# Altium schematic sheet MP9928_converter.SchDoc
size A; SheetNumber: 4; SheetTotal: 8
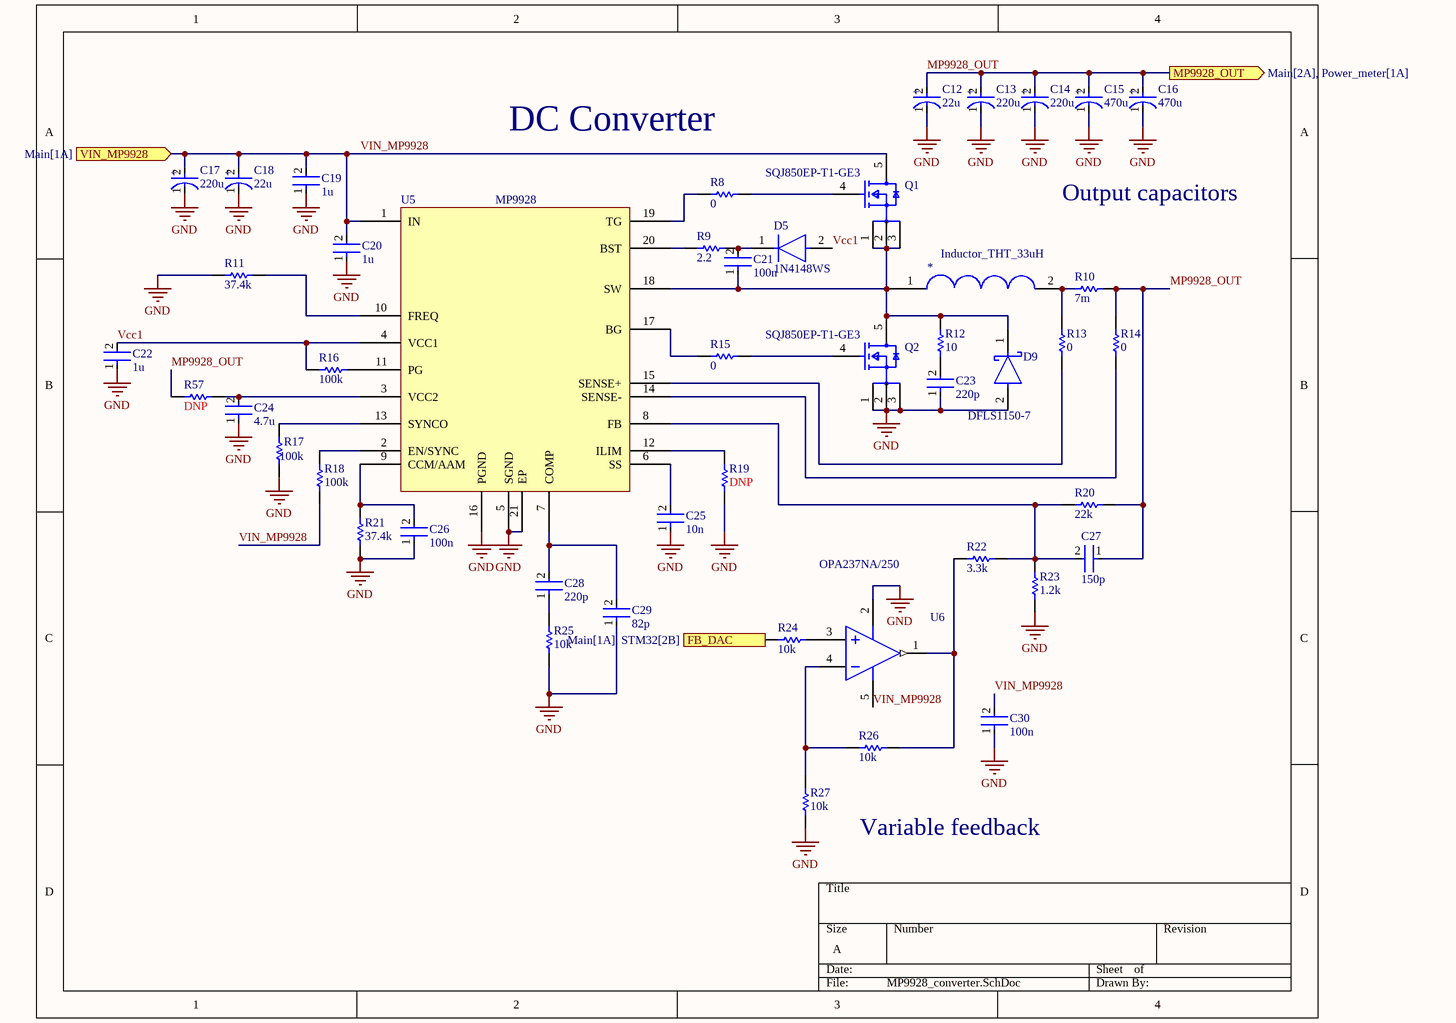
[diagram p0: MP9928_converter.SchDoc]

## Parts
*  Inductor_THT_33uH  [Inductor_THT]
C12  22u  [FP-FKG-MFG]
C13  220u  [FP-FKG-MFG]
C14  220u  [FP-FKG-MFG]
C15  470u  [FP-FKJ16-MFG]
C16  470u  [FP-FKJ16-MFG]
C17  220u  [FP-FKG-MFG]
C18  22u  [FP-FKG-MFG]
C19  1u  [FP-0805-L_2_01_0_2-W_1_25-IPC_B]
C20  1u  [FP-0805-L_2_01_0_2-W_1_25-IPC_B]
C21  100n  [FP-0805-L_2_01_0_2-W_1_25-IPC_B]
C22  1u  [FP-0805-L_2_01_0_2-W_1_25-IPC_B]
C23  220p  [FP-0805-L_2_01_0_2-W_1_25-IPC_B]
C24  4.7u  [FP-0805-L_2_01_0_2-W_1_25-IPC_B]
C25  10n  [FP-0805-L_2_01_0_2-W_1_25-IPC_B]
C26  100n  [FP-0805-L_2_01_0_2-W_1_25-IPC_B]
C27  150p  [FP-0805-L_2_01_0_2-W_1_25-IPC_B]
C28  220p  [FP-0805-L_2_01_0_2-W_1_25-IPC_B]
C29  82p  [FP-0805-L_2_01_0_2-W_1_25-IPC_B]
C30  100n  [FP-0805-L_2_01_0_2-W_1_25-IPC_B]
D5  1N4148WS  [FP-477AB-IPC_C]
D9  DFLS1150-7  [FP-PowerDI123-MFG]
Q1  SQJ850EP-T1-GE3  [FP-T16-0221-SINGLE-MFG]
Q2  SQJ850EP-T1-GE3  [FP-T16-0221-SINGLE-MFG]
R8  0  [RESC2013X50X30LL20T20]
R9  2.2  [RESC2013X50X30LL20T20]
R10  7m  [RESC3216X70X50NL05T20]
R11  37.4k  [RESC2013X50X30LL20T20]
R12  10  [RESC2013X50X30LL20T20]
R13  0  [RESC2013X50X30LL20T20]
R14  0  [RESC2013X50X30LL20T20]
R15  0  [RESC2013X50X30LL20T20]
R16  100k  [RESC2013X50X30LL20T20]
R17  100k  [RESC2013X50X30LL20T20]
R18  100k  [RESC2013X50X30LL20T20]
R19  DNP  [RESC2013X50X30LL20T20]
R20  22k  [RESC2013X50X30LL20T20]
R21  37.4k  [RESC2013X50X30LL20T20]
R22  3.3k  [RESC2013X50X30LL20T20]
R23  1.2k  [RESC2013X50X30LL20T20]
R24  10k  [RESC2013X50X30LL20T20]
R25  10k  [RESC2013X50X30LL20T20]
R26  10k  [RESC2013X50X30LL20T20]
R27  10k  [RESC2013X50X30LL20T20]
R57  DNP  [RESC2013X50X30LL20T20]
U5  MP9928  [SOP65P640X110-21N]
U6  OPA237NA/250  [DBV0005A_N]

## Ports
FB_DAC (in, see Main[1A], STM32[2B]), MP9928_OUT (out, see Main[2A], Power_meter[1A]), VIN_MP9928 (in, see Main[1A])

## Nets
GND: C12.1(C) C13.1(C) C14.1(C) C15.1(C) C16.1(C) C17.1(C) C18.1(C) C19.1 C20.1 C22.1 C23.1 C24.1 C25.1 C26.1 C29.1 C30.1 D9.2(A) Q2.1(S) Q2.2(S) Q2.3(S) R11.1 R17.2 R19.2 R21.2 R23.2 R25.2 R27.2 U5.5(SGND) U5.16(PGND) U5.21(EP) U6.2(V-)
FB_DAC: R24.1 ; port FB_DAC
MP9928_OUT: C12.2(A) C13.2(A) C14.2(A) C15.2(A) C16.2(A) C27.1 R10.2 R14.1 R20.2 R57.1 ; port MP9928_OUT
Vcc1: C22.2 D5.2(A) R16.2 U5.4(VCC1)
VIN_MP9928: C17.2(A) C18.2(A) C19.2 C20.2 C30.2 Q1.5(D) R18.2 U5.1(IN) U6.5(V+) ; port VIN_MP9928
Net*_1: *.1 C21.1 D9.1(C) Q1.1(S) Q1.2(S) Q1.3(S) Q2.5(D) R12.1 U5.18(SW)
Net*_2: *.2 R10.1 R13.1
NetC21_2: C21.2 D5.1(C) R9.1
NetC23_2: C23.2 R12.2
NetC24_2: C24.2 R57.2 U5.3(VCC2)
NetC25_2: C25.2 U5.6(SS)
NetC26_2: C26.2 R21.1 U5.9(CCM/AAM)
NetC27_2: C27.2 R20.1 R22.1 R23.1 U5.8(FB)
NetC28_1: C28.1 R25.1
NetC28_2: C28.2 C29.2 U5.7(COMP)
NetQ1_4: Q1.4(G) R8.1
NetQ2_4: Q2.4(G) R15.1
NetR8_2: R8.2 U5.19(TG)
NetR9_2: R9.2 U5.20(BST)
NetR11_2: R11.2 U5.10(FREQ)
NetR13_2: R13.2 U5.15(SENSE+)
NetR14_2: R14.2 U5.14(SENSE-)
NetR15_2: R15.2 U5.17(BG)
NetR16_1: R16.1 U5.11(PG)
NetR17_1: R17.1 U5.13(SYNCO)
NetR18_1: R18.1 U5.2(EN/SYNC)
NetR19_1: R19.1 U5.12(ILIM)
NetR22_2: R22.2 R26.2 U6.1(OUT)
NetR24_2: R24.2 U6.3(IN+)
NetR26_1: R26.1 R27.1 U6.4(IN-)

## Notes on the sheet
- DC Converter
- Output capacitors
- Variable feedback
- (in symbol CMP-05427-000014-1) +
- (in symbol CMP-05427-002167-1) +

## Library data of the parts
C12-C14 C17 C18 = CMP-05427-000014-1: CAP ALUM 220UF 20% 50V SMD; Manufacturer: Panasonic; Manufacturer Part Number: EEEFK1H221P; Material: Aluminum; Leakage Current: 110uA; Ripple Current: 670mA; Life: 2000Hours; Esr: 0.18Ω; Automotive Grade: Grade 2; Dissipation Factor: 10%; Tolerance: 20%; Device Class L3: Aluminum Electrolytic Capacitors; ComponentLink2Description: Datasheet; Temperature Range High: +105°C; Digikey Description: CAP ALUM 220UF 20% 50V SMD; Temperature: -55°C to +105°C; Temperature Range Low: -55°C; Height: 10.5mm; Voltage Rating: 50V; Value: 220uF; Capacitance: 220uF; Automotive: Yes; ComponentLink2URL: https://industrial.panasonic.com/cdbs/www-data/pdf/RDE0000/ABA0000C1181.pdf; Package: FKG; Device Class L2: Capacitors; Lead Free: Yes; Device Class L1: Passive Components; RoHS: TRUE; Mouser Description: Cap Aluminum Lytic 220uF 50V 20% (10 X 10.2mm) SMD 670mA 2000h 105C Automotive T/R; Octopart: https://octopart.com/eeefk1h221p-panasonic-1332836; Category: Cap
C15 C16 = CMP-05427-002167-1: CAP ALUM 470UF 20% 50V SMD; Impedance: 73mR; Ripple Current: 1.61A; Polarity: Polar; Life (Hours): 5000Hour; Dissipation Factor: 0.12%; Height - Seated (Max): 0.669inch; Reach SVHC Compliant: Yes; Termination: SMD/SMT; Mount: Surface Mount; Voltage: 50V; Ratings: AEC-Q200; Series: FK; Tolerance: 20%; ESR (Equivalent Series Resistance): 73mR; Construction: Cylindrical; Length: 16.5mm; Lead Free: Lead Free; Radiation Hardening: No; Package Quantity: 125; Min Operating Temperature: -55°C; Case/Package: Radial; Capacitance: 470uF; Ripple Current (AC): 1.61A; Diameter: 16mm; Voltage Rating (DC): 50V; Height: 16.5mm; Packaging: Tape and Reel; Max Operating Temperature: 105°C; Voltage Rating: 50V; RoHS Compliant: Yes
C19-C30 = CMP-2007-04174-2: General Purpose Ceramic Capacitor, 0805, 100nF, 10%, X7R, 15%, 100V; Packaging: Tape and Reel; Min Operating Temperature: -55°C; Dielectric Material: Ceramic; Height: 1.4mm; Voltage Rating: 100V; Termination: SMD/SMT; Case Code (Imperial): 0805; Case Code (Metric): 2012; Case/Package: 0805; Construction: Flat; Radiation Hardening: No; Series: -; Dielectric: X7R; Package Quantity: 2000; Mount: Surface Mount; Capacitance: 100nF; Contact Plating: Tin; Voltage: 100V; Lead Free: Lead Free; Depth: 1.25mm; RoHS Compliant: Yes; Number of Pins: 2; Max Operating Temperature: 125°C; Length: 2.01mm; Voltage Rating (DC): 100V; Thickness: 0.055inch; REACH SVHC: No SVHC; Width: 0.049inch; Tolerance: 10%
D5 = CMP-07163-000040-1: DIODE GEN PURP 75V 150MA SOD323F; Forward Voltage: 1V; Power Dissipation: 200mW; Element Configuration: Single; Max Forward Surge Current (Ifsm): 2A; Peak Reverse Current: 5uA; Recovery Time: 4ns; Package Quantity: 1; Number of Pins: 2; Height: 1mm; REACH SVHC: No SVHC; Max Reverse Voltage (DC): 75V; Forward Current: 150mA; Length: 1.8mm; Max Repetitive Reverse Voltage (Vrrm): 75V; Max Operating Temperature: 150°C; Average Rectified Current: 150mA; Contact Plating: Tin; Packaging: Tape and Reel; Radiation Hardening: No; Min Operating Temperature: -55°C; Width: 1.35mm; Weight: 0.0276g; Lead Free: Lead Free; Mount: Surface Mount; Reverse Voltage: 75V; Reverse Recovery Time: 4ns
D9 = CMP-12790-000012-1: DIODE SCHOTTKY 150V POWERDI123; Manufacturer: Diodes Inc.; Max Junction Temp: +175°C; Forward Current: 1A; Capacitance: 28pF; Automotive Grade: Grade 0; Peak Reverse Current: 2uA; Value: 28pF; Max Surge Forward Current: 50A; Automotive: Yes; Package: PowerDI123; Device Class L2: Diodes; RoHS: TRUE; Footprint Url: https://www.diodes.com/assets/Package-Files/PowerDI123.pdf; Max Repetitive Reverse Voltage: 150V; ComponentLink2Description: Datasheet; Device Class L3: Schottky Diodes; Lead Free: Yes; Digikey Description: DIODE SCHOTTKY 150V POWERDI123; Height: 1mm; Manufacturer Part Number: DFLS1150-7; Mouser Description: Schottky Diodes & Rectifiers 1.0A 150V; Temperature Range Low: -55°C; Octopart: https://octopart.com/dfls1150-7-diodes+inc.-328567; ComponentLink2URL: https://www.diodes.com/assets/Datasheets/ds30593.pdf; Category: Diode; Device Class L1: Discrete Semiconductors; Temperature Range High: +175°C; Temperature: -55°C to +175°C; Reverse Voltage: 150V
Q1 Q2 = CMP-02550-000213-1: MOSFET N-CH 60V 24A; Manufacturer: Vishay; Threshold Vgs Max: 2.5V; Standoff Height: 0mm; Turn Off Delay Time: 22ns; Gate Charge At Vgs: 20nC @ 10V; Max Forward Diode Voltage: 1.2V; Max Junction Temp: +175°C; Input Capacitace At Vds: 980pF @ 30V; Pulse Drain Current: 96A; Rthja Max: 70°C/W; Gate To Source Voltage: 20V; Threshold Vgs Min: 1.5V; Drain To Source Resistance: 0.019Ω; Automotive Grade: Grade 0; Typ Forward Diode Voltage: 0.8V; Transconductance: 29S; Depletion Mode: False; Turn On Delay Time: 21ns; Number Of Channels: 1; Power Dissipation: 45W; Category: Trans; Octopart: https://octopart.com/sqj850ep-t1_ge3-vishay-63675376; Device Class L3: MOSFETs; Digikey Description: MOSFET N-CH 60V 24A; Continuous Drain Current: 24A; ComponentLink2Description: Datasheet; Mouser Description: MOSFET 60V 24A 45W N-Ch Automotive; ComponentLink2URL: http://www.vishay.com/docs/65280/sqj850ep.pdf; Device Class L1: Discrete Semiconductors; Device Class L2: Transistors; Package: T16-0221-SINGLE; Temperature Range Low: -55°C; RoHS: TRUE; Drain To Source Breakdown Voltage: 60V; Manufacturer Part Number: SQJ850EP-T1-GE3; Lead Free: Yes; Drain To Source Voltage: 60V; Temperature: -55°C to +175°C; Automotive: Yes; Temperature Range High: +175°C; Height: 1.267mm; Number Of N Channels: 1
R8 R9 R11-R27 R57 = CMP-2001-04896-1: Manufacturer: Vishay Dale; Part Number: CRCW08050000Z0EA
R10 = CMP-2003-00761-1: Shunt resistor; Part Number: ERJ8BSFR10V; Manufacturer: Panasonic
U6 = CMP-0272-00854-3: Single-Supply Operational Amplifier MicroAmplifier(TM) Series, 2.7 to 36 V, -55 to 125 degC, 5-pin SOT23 (DBV5), Green (RoHS & no Sb/Br); Manufacturer: Texas Instruments; Total Supply Voltage(Max)(+5V is 5, +/-5V is 10): 36; Packing: SMALL T&R; CMRR(Min)(dB): 78; Vio (25C)(Max)(mV): 0.75; Total Supply Voltage(Min)(+5V is 5, +/-5V is 10): 2.7; Rating: Catalog; Slew Rate(Typ)(V/us): 0.5; Number of Channels: 1; GBW(Typ)(MHz): 1.4; Sub Family: High Supply Voltage Amplifier (>=30V), Low Power Amp (<=500uA), Low Supply Voltage Amplifier (<=2.7V), Precision Amplifier; IIB(Max)(pA): 40000; Iq per channel(Max)(mA): 0.35; Offset Drift(Typ)(uV/C): 2; DatasheetVersion: SBOS057A; PackageVersion: 4073253-4/K, 03/2006; ComponentLink1URL: http://www.ti.com/; ComponentLink2Description: Datasheet; ComponentLink3Description: Package Specification; PackageReference: DBV0005A; Mounting Technology: Surface Mount; ComponentLink3URL: http://www.ti.com/litv/pdf/mpds018i; PartNumber: OPA237NA/250; Eco-Plan: Green (RoHS & no Sb/Br); ComponentLink1Description: Manufacturer URL; PackageDescription: 5-Pin Plastic Small Outline, Body 1.6 x 2.9 mm, Pitch 0.95 mm; ComponentLink2URL: http://www.ti.com/lit/ds/symlink/opa237.pdf; Code_JEDEC: MO-178